# EasyEDA Pro project ProPrj_跟踪云台_2024-10-24-09-19-47.epro

# Schematic Schematic1
Board Name: Board1; Create Date: 2024-10-05
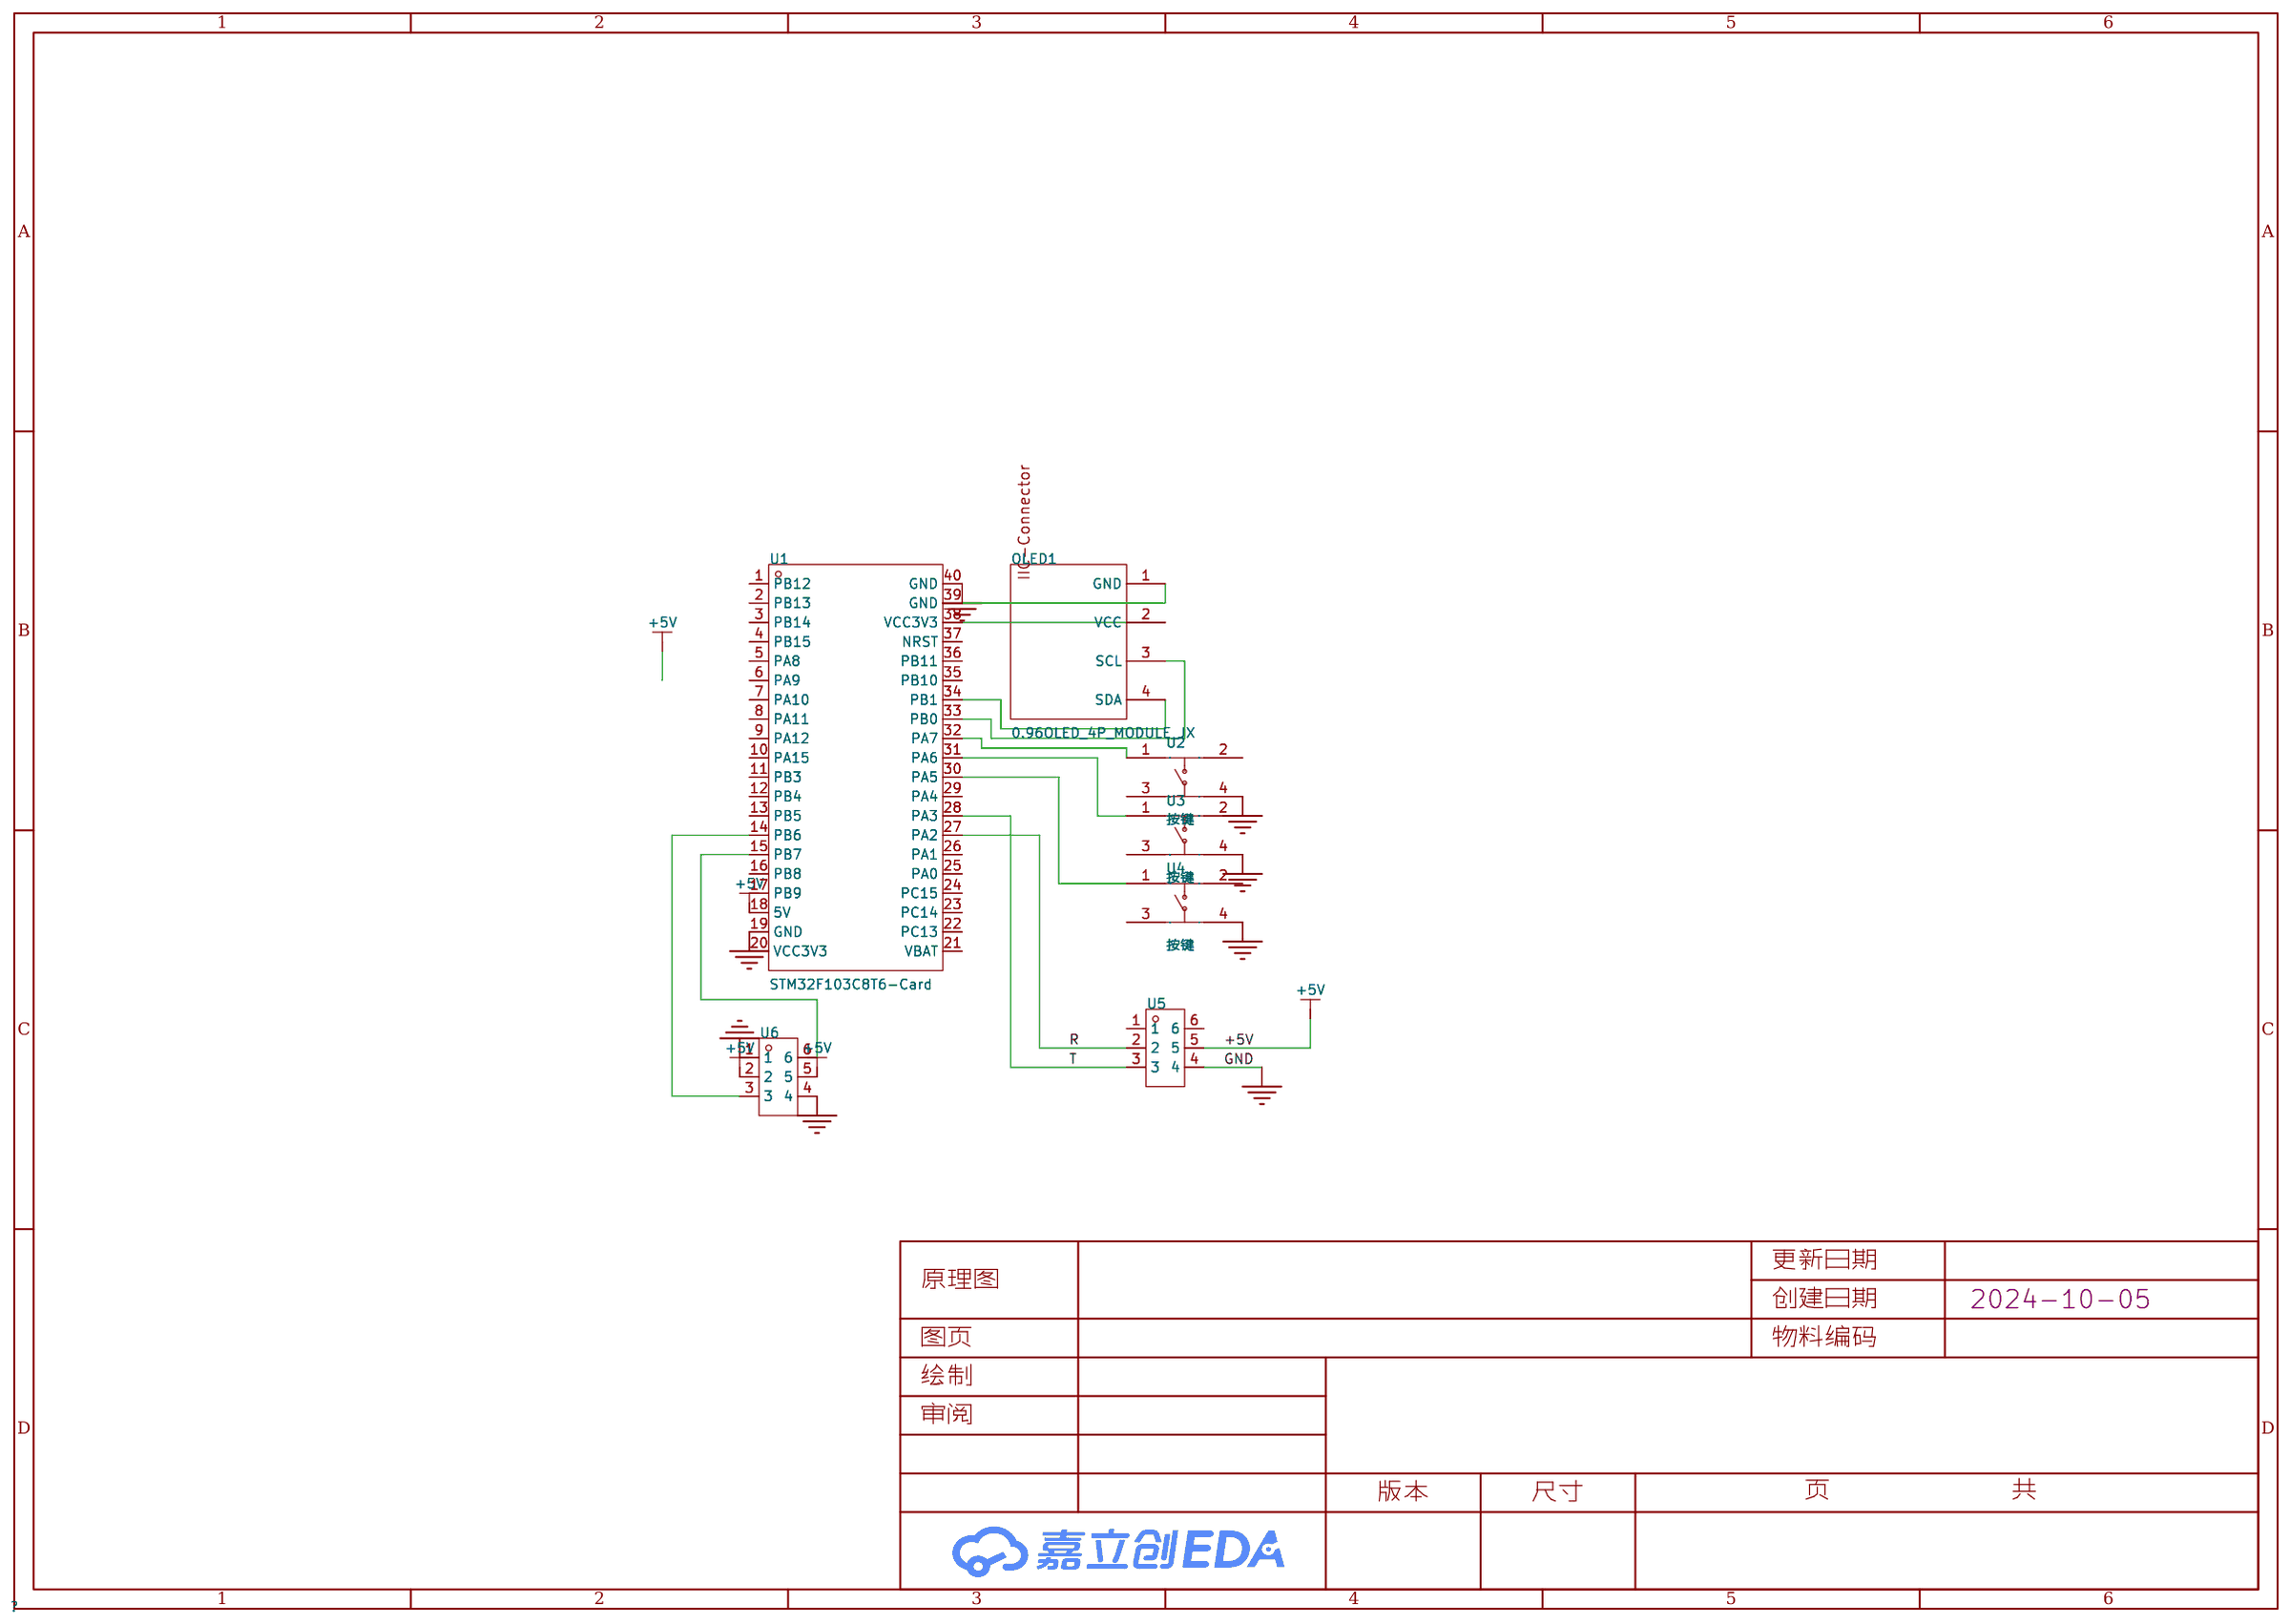
[diagram p0: schematic sheet]

## Parts
OLED1  0.96OLED_4P_MODULE_JX  [0.96OLED_4P]
U1  STM32F103C8T6-Card  [CONN-TH_L53.3-W22.9_STM32F103C8T6-CARD]
U2  按键  [SW-SMD_4P-L6.0-W6.0-P4.50-LS9.0-2]
U3  按键  [SW-SMD_4P-L6.0-W6.0-P4.50-LS9.0-2]
U4  按键  [SW-SMD_4P-L6.0-W6.0-P4.50-LS9.0-2]
U5  BL  [HDR-TH_6P-P2.54-V-F-2]
U6  BL  [HDR-TH_6P-P2.54-V-F-2]

## Library data of the parts
OLED1 = 0.96OLED_4P_MODULE_JX: Supplier Part: C9900004566; Supplier Footprint: 插件; JLCPCB Part Class: 扩展库; Supplier: LCSC
U1 = STM32F103C8T6-Card: Supplier Part: C9900077949; Supplier Footprint: 插件; Supplier: LCSC
U2-U4 = 按键: Supplier Part: C9900024939; Supplier Footprint: SW-SMD; JLCPCB Part Class: 扩展库; Supplier: LCSC
U5 U6 = OLED-6PIN: Supplier Part: C9900007737; JLCPCB Part Class: 扩展库; Supplier: LCSC

## Nets
+5V: U1.18(5V) U5.5 U6.2 U6.5
GND: U1.19(GND) U1.40(GND) U2.4 U3.4 U4.4 U5.4 U6.1 U6.4
R: U1.27(PA2) U5.2
T: U1.28(PA3) U5.3
$1N1166: OLED1.4(SDA) U1.34(PB1)
$1N1173: OLED1.1(GND) U1.39(GND)
$1N1207: OLED1.3(SCL) U1.33(PB0)
$1N1228: OLED1.2(VCC) U1.38(VCC3V3)
$1N1249: U1.32(PA7) U2.1
$1N1255: U1.31(PA6) U3.1
$1N1260: U1.30(PA5) U4.1
$1N2041: U1.14(PB6) U6.3
$1N2047: U1.15(PB7) U6.6

Not connected (* = marked no-connect by the designer): U1 1(PB12) 2(PB13) 3(PB14) 4(PB15) 5(PA8) 6(PA9) 7(PA10) 8(PA11) 9(PA12) 10(PA15) 11(PB3) 12(PB4) 13(PB5) 16(PB8) 17(PB9) 20(VCC3V3) 21(VBAT) 22(PC13) 23(PC14) 24(PC15) 25(PA0) 26(PA1) 29(PA4) 35(PB10) 36(PB11) 37(NRST); U2 2 3; U3 2 3; U4 2 3; U5 1 6

# Board PCB1
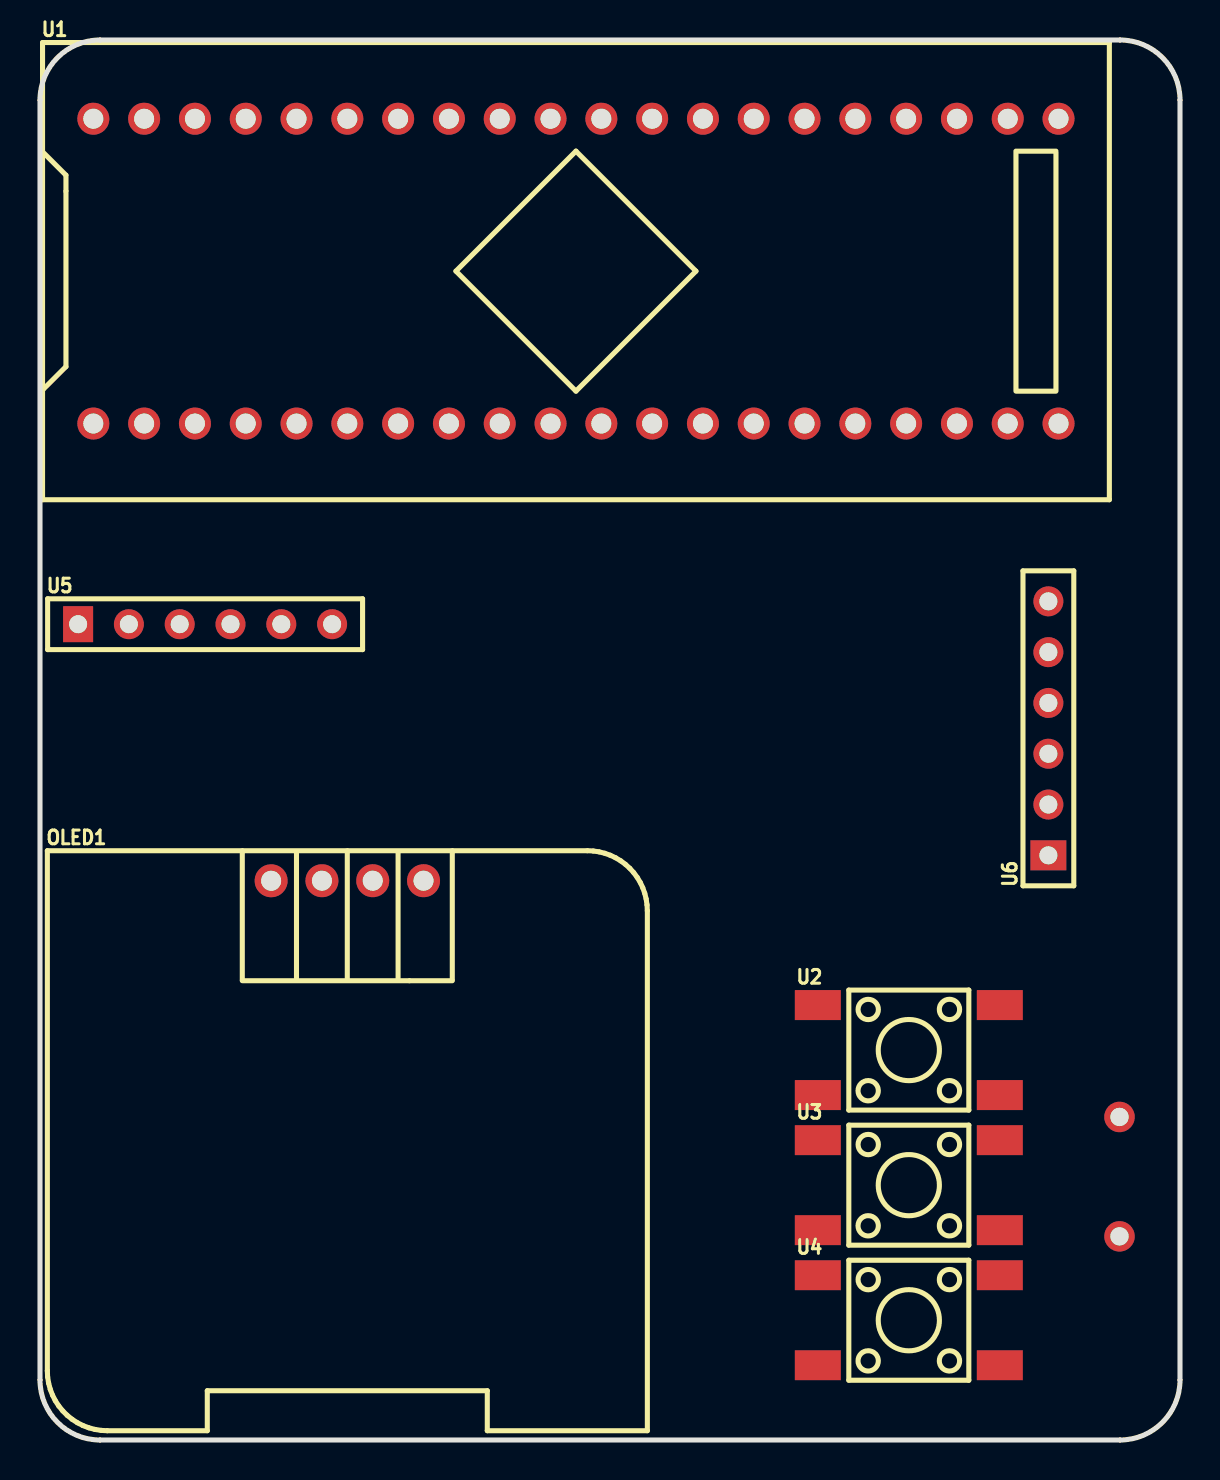
[diagram p1: board, top side]
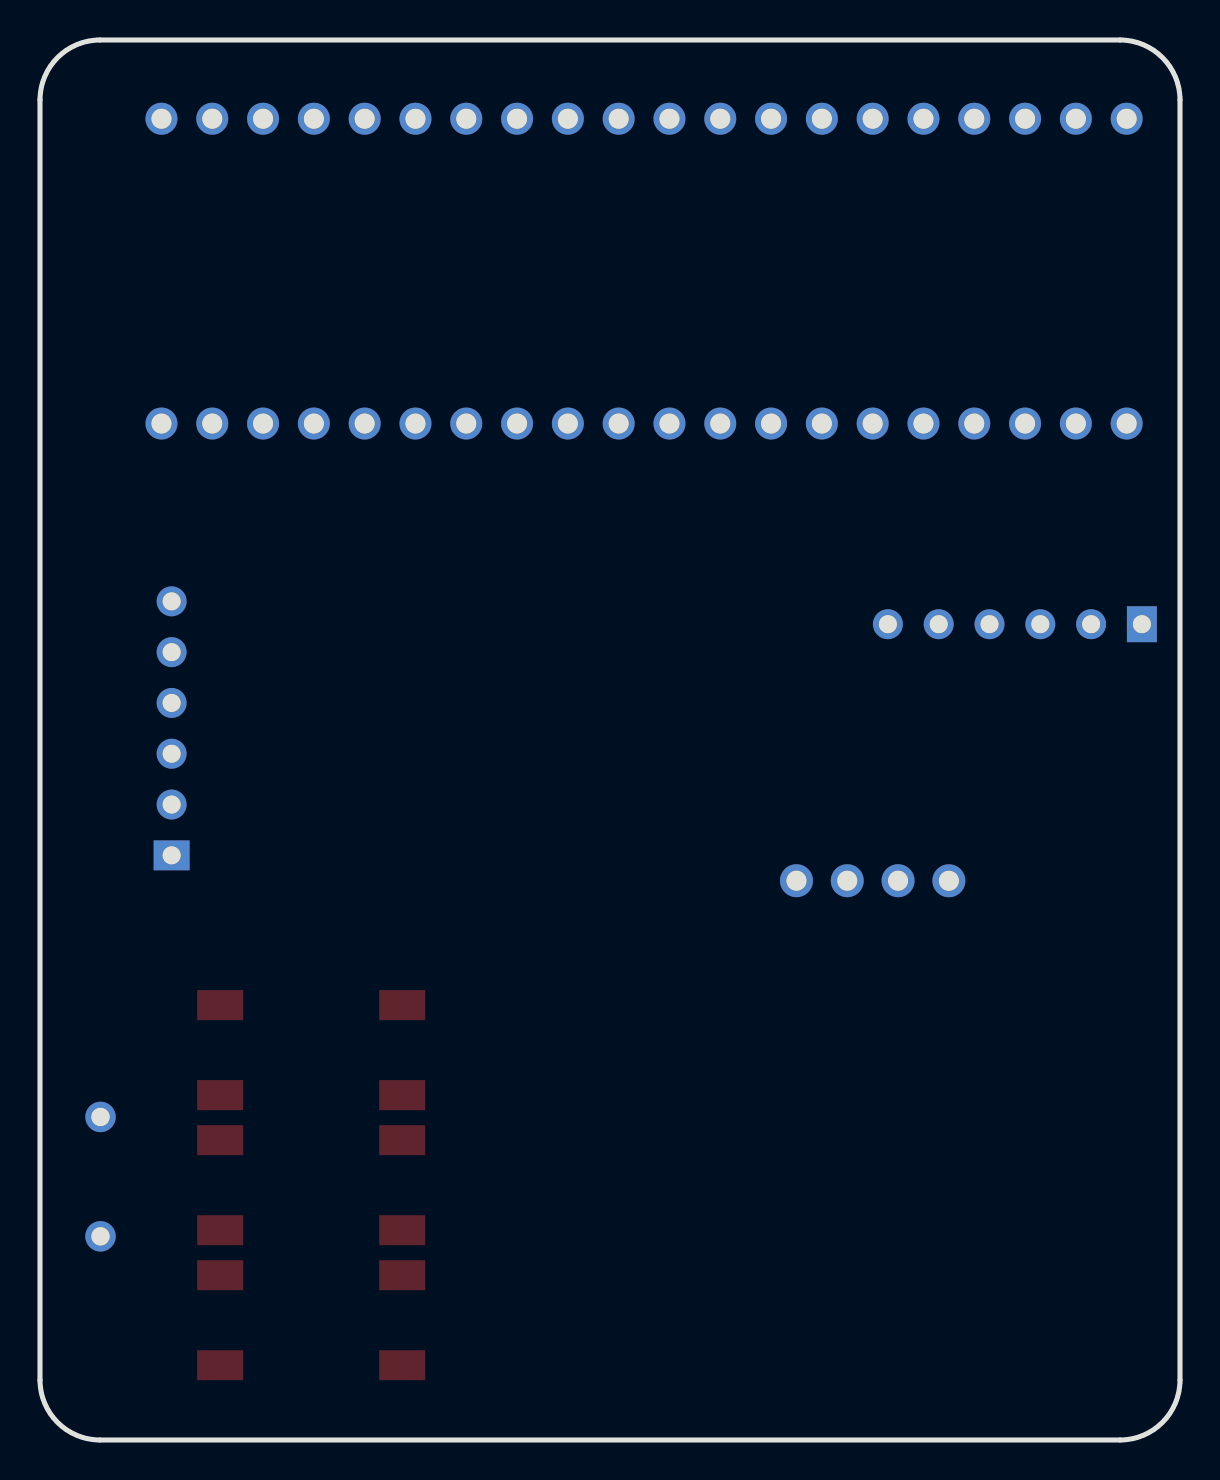
[diagram p2: board, bottom side, seen from below]

Outline 57 x 70 mm; copper layers: Top Layer, Bottom Layer. Coordinates in mm from the lower left corner of the outline.
Outline path: 0,67 0,3 arc(0.88,0.88) 3,0 54,0 arc(56.12,0.88) 57,3 57,67 arc(56.12,69.12) 54,70 3,70 arc(0.88,69.12) 0,67
Stack: Top Layer 0.035mm / Dielectric1 1.51mm FR4 er 4.5 / Bottom Layer 0.035mm

## Design rules (mm)
template: JLCPCB Capability(Two Layers Board)
spacing copperThickness1oz (default): track to track 0.102, other pairs 0.152 to 0.3
spacing copperThickness2oz: track to track 0.203, other pairs 0.152 to 0.3
track width copperThickness1oz (default): min 0.127, default 0.254, max 2.54
track width copperThickness2oz: min 0.203, default 0.254, max 2.54
differential pair differentialPair (default): width min 0.127, default 0.254, max 2.54; gap min 0.152, default 0.152
via viaSize (default): diameter min 0.5, default 0.61, max 10; hole min 0.3, default 0.305, max 6.3

## Placement (name value [footprint] x y rotation side)
NOREF  -  [Pad_e12]  53.97 16.15 0 top
NOREF#2  -  [Pad_e13]  53.97 10.18 0 top
OLED1  0.96OLED_4P_MODULE_JX  [0.96OLED_4P]  15.37 27.96 0 top
U1  STM32F103C8T6-Card  [CONN-TH_L53.3-W22.9_STM32F103C8T6-CARD]  26.8 58.44 0 top
U2  按键  [SW-SMD_4P-L6.0-W6.0-P4.50-LS9.0-2]  43.44 19.5 0 top
U3  按键  [SW-SMD_4P-L6.0-W6.0-P4.50-LS9.0-2]  43.44 12.74 0 top
U4  按键  [SW-SMD_4P-L6.0-W6.0-P4.50-LS9.0-2]  43.44 5.99 0 top
U5  BL  [HDR-TH_6P-P2.54-V-F-2]  8.25 40.79 0 top
U6  BL  [HDR-TH_6P-P2.54-V-F-2]  50.42 35.58 90 top

## Footprints (pads in the part's own frame, mm; a bottom-side part is the same pattern mirrored in y, then rotated)
0.96OLED_4P
  round 1.65 hole 1: 1(-3.81,-0.002) 2(-1.27,0.002) 3(1.27,0.002) 4(3.81,0.002)
CONN-TH_L53.3-W22.9_STM32F103C8T6-CARD
  round 1.6 hole 1: 1(-24.13,-7.62) 2(-21.59,-7.62) 3(-19.05,-7.62) 4(-16.51,-7.62) 5(-13.97,-7.62) 6(-11.43,-7.62) 7(-8.89,-7.62) 8(-6.35,-7.62) 9(-3.81,-7.62) 10(-1.27,-7.62) 11(1.27,-7.62) 12(3.81,-7.62) 13(6.35,-7.62) 14(8.89,-7.62) 15(11.43,-7.62) 16(13.97,-7.62) 17(16.51,-7.62) 18(19.05,-7.62) 19(21.59,-7.62) 20(24.13,-7.62) 21(24.13,7.62) 22(21.59,7.62) 23(19.05,7.62) 24(16.51,7.62) 25(13.97,7.62) 26(11.43,7.62) 27(8.89,7.62) 28(6.35,7.62) 29(3.81,7.62) 30(1.27,7.62) 31(-1.27,7.62) 32(-3.81,7.62) 33(-6.35,7.62) 34(-8.89,7.62) 35(-11.43,7.62) 36(-13.97,7.62) 37(-16.51,7.62) 38(-19.05,7.62) 39(-21.59,7.62) 40(-24.13,7.62)
HDR-TH_6P-P2.54-V-F-2
  rect 1.5x1.8 hole 0.9: 1(-6.35,0)
  round 1.5 hole 0.9: 2(-3.81,0) 3(-1.27,0) 4(1.27,0) 5(3.81,0) 6(6.35,0)
Pad_e12
  round 1.524 hole 0.914: 1(0,0)
Pad_e13
  round 1.524 hole 0.914: 2(0,0)
SW-SMD_4P-L6.0-W6.0-P4.50-LS9.0-2
  rect 2.3x1.5 smd: 1(-4.55,2.25) 2(4.55,2.25) 3(-4.55,-2.25) 4(4.55,-2.25)

## Nets
As in the schematic.

Pads without a net: NOREF 1; NOREF#2 2; U1 1 2 3 4 5 6 7 8 9 10 11 12 13 16 17 20 21 22 23 24 25 26 29 35 36 37; U2 2 3; U3 2 3; U4 2 3; U5 1 6
